# EAGLE design M162 (EAGLE 6.6.0)
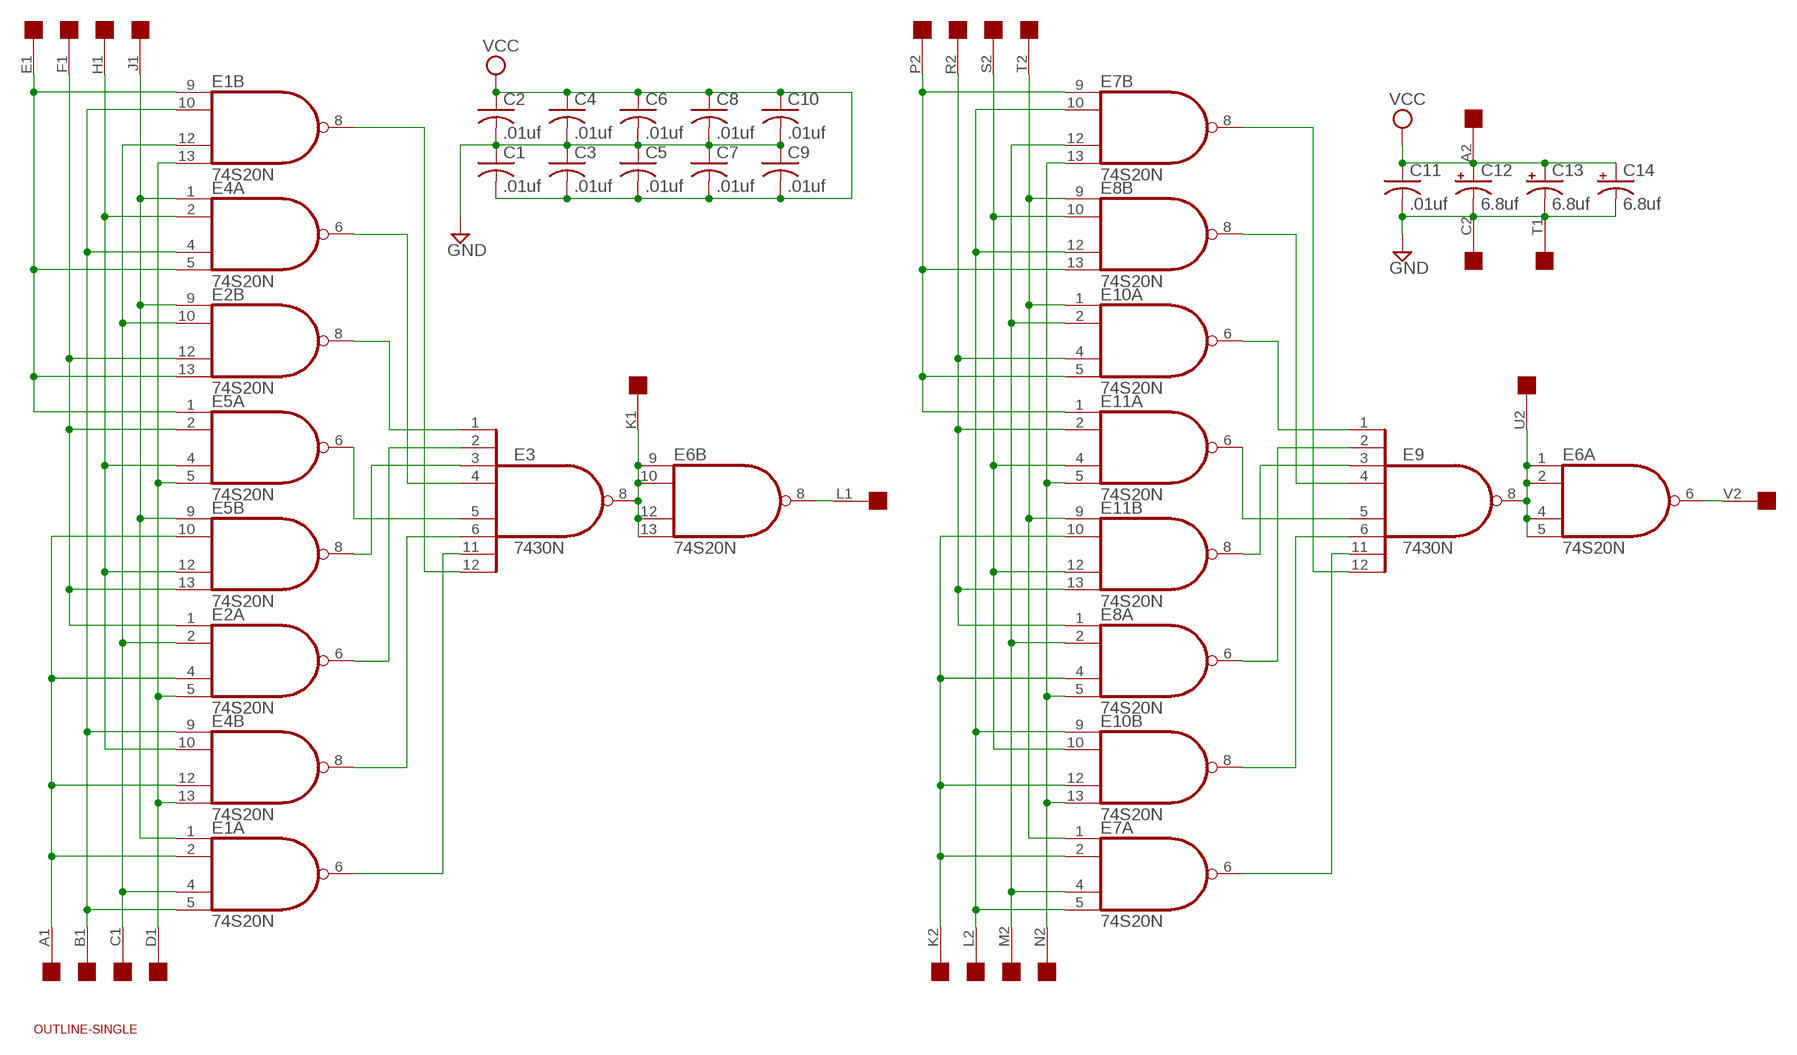
[diagram p0: schematic, sheet 1]

## Parts
C1  .01uf  C-US050-025X075  [C050-025X075]
C2  .01uf  C-US050-025X075  [C050-025X075]
C3  .01uf  C-US050-025X075  [C050-025X075]
C4  .01uf  C-US050-025X075  [C050-025X075]
C5  .01uf  C-US050-025X075  [C050-025X075]
C6  .01uf  C-US050-025X075  [C050-025X075]
C7  .01uf  C-US050-025X075  [C050-025X075]
C8  .01uf  C-US050-025X075  [C050-025X075]
C9  .01uf  C-US050-025X075  [C050-025X075]
C10  .01uf  C-US050-025X075  [C050-025X075]
C11  .01uf  C-US050-025X075  [C050-025X075]
C12  6.8uf  CPOL-USE22-6AXIAL  [E22-6]
C13  6.8uf  CPOL-USE22-6AXIAL  [E22-6]
C14  6.8uf  CPOL-USE22-6AXIAL  [E22-6]
E1  74S20N  [DIL14]
E2  74S20N  [DIL14]
E3  7430N  [DIL14]
E4  74S20N  [DIL14]
E5  74S20N  [DIL14]
E6  74S20N  [DIL14]
E7  74S20N  [DIL14]
E8  74S20N  [DIL14]
E9  7430N  [DIL14]
E10  74S20N  [DIL14]
E11  74S20N  [DIL14]
U$1  OUTLINE-SINGLE  [SINGLE]
U$2  EDGE-2CONNECTOR  [EDGE-CON2]

## Nets
GND: C1.1 C2.2 C3.1 C4.2 C5.1 C6.2 C7.1 C8.2 C9.1 C10.2 C11.2 C12.- C13.- C14.- U$2.C2 U$2.T1
N$1: E1.2(A:I1) E2.4(A:I2) E4.12(B:I2) E5.10(B:I1) U$2.A1
N$2: E1.13(B:I3) E2.5(A:I3) E4.13(B:I3) E5.5(A:I3) U$2.D1
N$3: E1.1(A:I0) E2.9(B:I0) E4.1(A:I0) E5.9(B:I0) U$2.J1
N$4: E4.2(A:I1) E4.10(B:I1) E5.4(A:I2) E5.12(B:I2) U$2.H1
N$5: E1.4(A:I2) E1.12(B:I2) E2.2(A:I1) E2.10(B:I1) U$2.C1
N$6: E1.5(A:I3) E1.10(B:I1) E4.4(A:I2) E4.9(B:I0) U$2.B1
N$7: E2.1(A:I0) E2.12(B:I2) E5.2(A:I1) E5.13(B:I3) U$2.F1
N$8: E1.9(B:I0) E2.13(B:I3) E4.5(A:I3) E5.1(A:I0) U$2.E1
N$9: E1.8(B:O) E3.12(I7)
N$10: E3.4(I3) E4.6(A:O)
N$11: E2.8(B:O) E3.1(I0)
N$12: E3.5(I4) E5.6(A:O)
N$13: E3.3(I2) E5.8(B:O)
N$14: E2.6(A:O) E3.2(I1)
N$15: E1.6(A:O) E3.11(I6)
N$16: E3.6(I5) E4.8(B:O)
N$17: E3.8(O) E6.9(B:I0) E6.10(B:I1) E6.12(B:I2) E6.13(B:I3) U$2.K1
N$18: E7.2(A:I1) E8.4(A:I2) E10.12(B:I2) E11.10(B:I1) U$2.K2
N$19: E7.13(B:I3) E8.5(A:I3) E10.13(B:I3) E11.5(A:I3) U$2.N2
N$20: E7.1(A:I0) E8.9(B:I0) E10.1(A:I0) E11.9(B:I0) U$2.T2
N$21: E8.10(B:I1) E10.10(B:I1) E11.4(A:I2) E11.12(B:I2) U$2.S2
N$22: E7.4(A:I2) E7.12(B:I2) E8.2(A:I1) E10.2(A:I1) U$2.M2
N$23: E7.5(A:I3) E7.10(B:I1) E8.12(B:I2) E10.9(B:I0) U$2.L2
N$24: E8.1(A:I0) E10.4(A:I2) E11.2(A:I1) E11.13(B:I3) U$2.R2
N$25: E7.9(B:I0) E8.13(B:I3) E10.5(A:I3) E11.1(A:I0) U$2.P2
N$26: E7.8(B:O) E9.12(I7)
N$27: E8.8(B:O) E9.4(I3)
N$28: E9.1(I0) E10.6(A:O)
N$29: E9.5(I4) E11.6(A:O)
N$30: E9.3(I2) E11.8(B:O)
N$31: E8.6(A:O) E9.2(I1)
N$32: E7.6(A:O) E9.11(I6)
N$33: E9.6(I5) E10.8(B:O)
N$34: E6.1(A:I0) E6.2(A:I1) E6.4(A:I2) E6.5(A:I3) E9.8(O) U$2.U2
N$35: E6.6(A:O) U$2.V2
N$36: E6.8(B:O) U$2.L1
VCC: C1.2 C2.1 C3.2 C4.1 C5.2 C6.1 C7.2 C8.1 C9.2 C10.1 C11.1 C12.+ C13.+ C14.+ U$2.A2
Unconnected: U$2.B2 U$2.D2 U$2.E2 U$2.F2 U$2.H2 U$2.J2 U$2.M1 U$2.N1 U$2.P1 U$2.R1 U$2.S1 U$2.U1 U$2.V1

## Power pins joined to a net without a drawn wire
GND: E1.7(P:GND) E2.7(P:GND) E3.7(GND) E4.7(P:GND) E5.7(P:GND) E6.7(P:GND) E7.7(P:GND) E8.7(P:GND) E9.7(GND) E10.7(P:GND) E11.7(P:GND)
VCC: E1.14(P:VCC) E2.14(P:VCC) E3.14(VCC) E4.14(P:VCC) E5.14(P:VCC) E6.14(P:VCC) E7.14(P:VCC) E8.14(P:VCC) E9.14(VCC) E10.14(P:VCC) E11.14(P:VCC)

## Library data of the parts
C1-C11 = rcl:C-US: CAPACITOR, American symbol
C12-C14 = rcl:CPOL-US: POLARIZED CAPACITOR, American symbol
E1 E2 E4-E8 E10 E11 = 74xx-us:74*20: Dual 4-input NAND gate
E3 E9 = 74xx-us:74*30: 8-input NAND gate
U$1 = dec-con:OUTLINE-*: Board outlines for DEC boards.
U$2 = dec-con:EDGE-2: Double-Sided DEC edge connector.

## Board
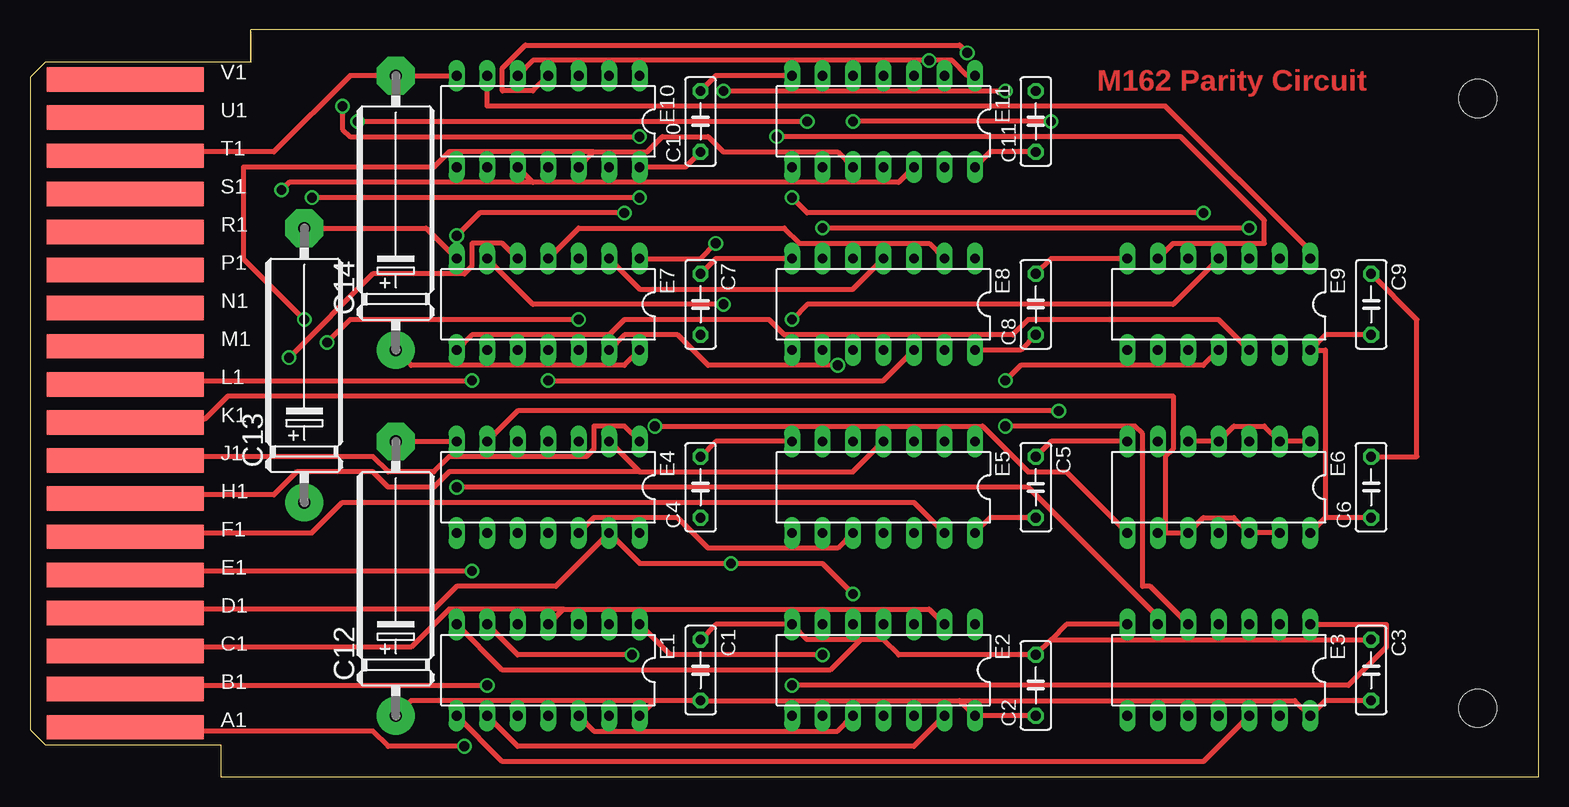
[diagram p1: board, top side]
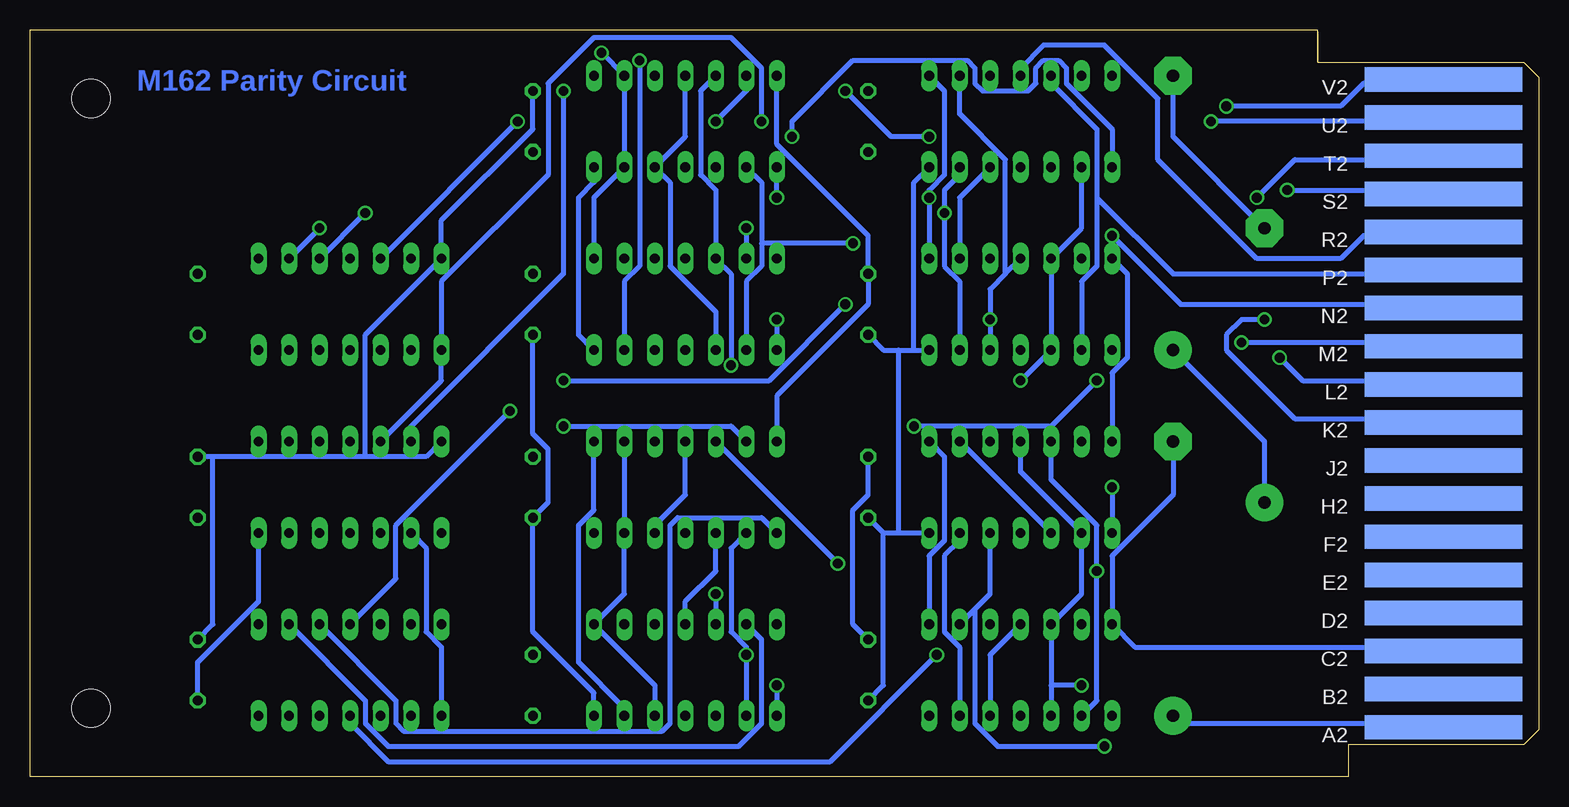
[diagram p2: board, bottom side, seen from below]

Size 125.73 x 62.23 mm. Coordinates in mm from the lower left corner, seen from the top.
Copper layers (1+16): Top 0.035mm / dielectric 1.5mm / Bottom 0.035mm
Design rules "16mils": minimum track width 16mil, minimum drill 32mil, track to track 15mil, track to pad 10mil, pad to pad 10mil, via to via 10mil, smd to smd 10mil, copper to edge 13mil, drill to drill 10mil, minimum pad ring 10mil, minimum via ring 8mil, stop-mask expansion 0mil, vias tented up to drill 0mil, thermal gap 10mil

### Footprints (pad centres in the part's own frame; a part is rotated, then mirrored left to right if it is on the bottom)
C050-025X075 = drill 0.813 octagon: 1 -2.54,0; 2 2.54,0
E22-6 = drill 1.016 pad 3.15: + -11.43,0 | drill 1.016 pad 3.15 octagon: - 11.43,0
DIL14 = drill 0.813 long: 1 -7.62,-3.81; 2 -5.08,-3.81; 3 -2.54,-3.81; 4 0,-3.81; 5 2.54,-3.81; 6 5.08,-3.81; 7 7.62,-3.81; 8 7.62,3.81; 9 5.08,3.81; 10 2.54,3.81; 11 0,3.81; 12 -2.54,3.81; 13 -5.08,3.81; 14 -7.62,3.81
SINGLE = hole 3.175: 120.65,56.515; 120.65,5.715
EDGE-CON2 = smd 13.106 x 2.032: A1 7.938,4.128; B1 7.938,7.303; C1 7.938,10.477; D1 7.938,13.652; E1 7.938,16.828; F1 7.938,20.003; H1 7.938,23.177; J1 7.938,26.352; K1 7.938,29.527; L1 7.938,32.703; M1 7.938,35.877; N1 7.938,39.053; P1 7.938,42.227; R1 7.938,45.403; S1 7.938,48.578; T1 7.938,51.752; U1 7.938,54.928; V1 7.938,58.102 | smd 13.106 x 2.032 bottom: A2 7.938,4.128; B2 7.938,7.303; C2 7.938,10.477; D2 7.938,13.652; E2 7.938,16.828; F2 7.938,20.003; H2 7.938,23.177; J2 7.938,26.352; K2 7.938,29.527; L2 7.938,32.703; M2 7.938,35.877; N2 7.938,39.053; P2 7.938,42.227; R2 7.938,45.403; S2 7.938,48.578; T2 7.938,51.752; U2 7.938,54.928; V2 7.938,58.102

### Placement (x,y rotation side)
C1  55.88,8.89 270 top
C2  83.82,7.62 90 top
C3  111.76,8.89 270 top
C4  55.88,24.13 90 top
C5  83.82,24.13 270 top
C6  111.76,24.13 90 top
C7  55.88,39.37 270 top
C8  83.82,39.37 90 top
C9  111.76,39.37 270 top
C10  55.88,54.61 90 top
C11  83.82,54.61 90 top
C12  30.48,16.51 90 top
C13  22.86,34.29 90 top
C14  30.48,46.99 90 top
E1  43.18,8.89 180 top
E2  71.12,8.89 180 top
E3  99.06,8.89 180 top
E4  43.18,24.13 180 top
E5  71.12,24.13 180 top
E6  99.06,24.13 180 top
E7  43.18,39.37 180 top
E8  71.12,39.37 180 top
E9  99.06,39.37 180 top
E10  43.18,54.61 180 top
E11  71.12,54.61 180 top
U$1  0,0 0 top
U$2  0,0 0 top

### Tracks (layer width: path | path; a pad name or v marks a point on that pad's centre or on a via)
GND
  Top 0.406: C12.- E4.7 | E10.7 C14.- 26.67,58.42 20.32,52.07 8.26,52.07 U$2.T1 | E7.7 33.02,45.72 C13.- | C8.2 85.09,43.18 E9.7 | C5.1 85.09,27.94 E6.7 | C9.1 115.57,38.1 115.57,26.67 C6.2 | C10.2 57.15,58.42 E11.7 | C4.2 57.15,27.94 E5.7 | C7.1 57.15,43.18 E8.7 | C1.1 57.15,12.7 E2.7 64.77,11.43 69.22,11.43 | 85.09,11.43 86.36,12.7 E3.7 | 85.09,11.43 C2.2 72.39,10.16 71.12,11.43 69.22,11.43 | 85.09,11.43 C3.1 | E1.7 39.37,8.89 66.68,8.89 69.22,11.43
  Bottom 0.406: C12.- 30.48,23.5 35.56,18.41 E1.7 33.66,10.79 8.26,10.79 U$2.C2 | C14.- 30.48,53.34 C13.- | E4.7 35.56,33.66 34.29,34.92 34.29,41.91 E7.7 | C11.2 83.82,53.98 91.44,46.35 E9.7 97.79,36.83 97.79,26.67 | 97.79,26.67 92.71,26.67 E6.7 | 97.79,26.67 110.49,26.67 | 110.49,26.67 C6.2 | E5.7 63.5,31.75 55.88,39.37 C7.1 55.88,45.09 63.5,52.7 E11.7 | C4.2 55.88,23.5 57.15,22.23 57.15,12.7 C1.1 | 110.49,26.67 110.49,12.7 C3.1
N$1  (via drill 0.81)
  Top 0.406: E4.12 46.99,21.59 53.98,21.59 56.52,19.05 67.31,19.05 E5.10 | v36.2,2.54 29.85,2.54 28.58,3.81 8.26,3.81 U$2.A1
  Bottom 0.406: E4.12 45.72,15.24 46.99,13.97 | E1.2 46.99,13.97 | E5.10 68.58,17.14 71.12,14.61 E2.4 | v36.2,2.54 45.09,2.54 46.99,4.45 46.99,13.97
N$2  (via drill 0.81)
  Top 0.406: v68.58,15.24 66.04,17.78 v58.42,17.78 50.8,17.78 E4.13 43.82,15.88 35.56,15.88 33.66,13.97 8.26,13.97 U$2.D1
  Bottom 0.406: E1.13 48.26,10.79 49.53,12.06 49.53,18.41 48.26,19.68 E4.13 | v68.58,15.24 E2.5 | v58.42,17.78 E5.5
N$3  (via drill 0.81)
  Top 0.406: E1.1 53.34,10.16 v66.04,10.16 | E4.1 49.53,29.21 46.99,29.21 46.99,27.3 46.36,26.67 34.93,26.67 33.66,25.4 29.85,25.4 28.58,26.67 8.26,26.67 U$2.J1
  Bottom 0.406: E1.1 50.8,18.41 49.53,19.68 49.53,26.67 E4.1 | E2.9 v66.04,10.16 66.04,10.79 67.31,12.06 67.31,19.05 E5.9
N$4
  Top 0.406: E5.4 68.58,25.4 50.8,25.4 | E4.2 50.8,25.4 | 50.8,25.4 34.93,25.4 33.66,24.13 29.85,24.13 28.58,25.4 22.23,25.4 20.32,23.5 8.26,23.5 U$2.H1
  Bottom 0.406: E5.4 71.12,23.5 73.66,20.95 E5.12 | E4.2 E4.10
N$5
  Top 0.406: E2.10 67.31,3.81 46.99,3.81 E1.12 | E2.2 74.93,13.97 44.45,13.97 | E1.4 44.45,13.97 | 44.45,13.97 34.93,13.97 31.75,10.79 8.26,10.79 U$2.C1
  Bottom 0.406: E1.12 45.72,10.16 E1.4
N$6  (via drill 0.81)
  Top 0.406: v38.1,7.62 8.26,7.62 U$2.B1
  Bottom 0.406: 40.64,7.62 E1.5 38.1,15.24 E4.9 43.18,25.4 E4.4 | 40.64,7.62 E1.10 | v38.1,7.62 40.64,7.62
N$7
  Top 0.406: E5.13 73.66,22.86 26.04,22.86 23.5,20.32 8.26,20.32 U$2.F1
  Bottom 0.406: E5.2 E5.13 76.2,15.24 E2.1 73.66,7.62 E2.12
N$8  (via drill 0.81)
  Top 0.406: E1.9 40.64,2.54 73.66,2.54 E2.13 | v36.83,17.14 8.26,17.14 U$2.E1
  Bottom 0.406: E4.5 40.64,24.77 36.83,20.95 v36.83,17.14 36.83,6.35 E1.9 | E5.1 78.74,22.23 80.01,20.95 80.01,9.53 76.2,5.71 E2.13
N$9
  Top 0.406: E1.8 39.37,1.27 97.79,1.27 E3.12
N$10  (via drill 0.81)
  Top 0.406: E4.6 40.64,30.48 v85.73,30.48
  Bottom 0.406: v85.73,30.48 95.25,20.95 95.25,16.51 E3.4
N$11  (via drill 0.81)
  Top 0.406: v63.5,7.62 109.86,7.62 113.03,10.79 113.03,12.7 E3.1
  Bottom 0.406: v63.5,7.62 E2.8
N$12  (via drill 0.81)
  Top 0.406: v81.28,29.21 92.08,29.21 92.71,28.57 92.71,15.88 93.35,15.88 E3.5
  Bottom 0.406: E5.6 67.31,29.21 v81.28,29.21
N$13
  Bottom 0.406: E5.8 64.77,21.59 71.76,21.59 72.39,20.95 72.39,4.45 73.03,3.81 94.62,3.81 95.25,4.45 95.25,6.35 E3.3
N$14
  Bottom 0.406: E2.6 64.77,11.43 64.77,4.45 66.68,2.54 95.89,2.54 97.79,4.45 97.79,6.35 E3.2
N$15  (via drill 0.81)
  Top 0.406: E1.6 40.64,10.16 v50.17,10.16
  Bottom 0.406: v50.17,10.16 59.06,1.27 95.89,1.27 99.06,4.45 E3.11
N$16  (via drill 0.81)
  Top 0.406: v35.56,24.13 83.19,24.13 93.98,13.34 E3.6
  Bottom 0.406: v35.56,24.13 E4.8
N$17
  Top 0.406: E6.13 E6.12 100.33,21.59 97.79,21.59 E6.10 94.62,20.32 | 94.62,20.32 94.62,26.67 95.25,27.3 95.25,31.75 16.51,31.75 14.61,29.84 8.26,29.84 U$2.K1 | 94.62,20.32 E6.9
  Bottom 0.406: E3.8 91.44,10.79 92.71,12.06 92.71,19.05 E6.9
N$18  (via drill 0.81)
  Top 0.406: E11.10 67.31,52.07 57.79,52.07 56.52,53.34 52.71,53.34 51.44,52.07 46.99,52.07 | E10.12 46.99,52.07 | E8.4 68.58,40.64 50.8,40.64 E7.2 | v22.86,38.1 17.78,43.18 17.78,50.8 33.66,50.8 34.93,52.07 46.99,52.07
  Bottom 0.406: E7.2 48.26,48.26 E10.12 | v22.86,38.1 24.77,38.1 26.04,36.83 26.04,35.56 20.32,29.84 8.26,29.84 U$2.K2
N$19  (via drill 0.81)
  Top 0.406: E7.13 49.53,36.83 53.98,36.83 56.52,34.29 v67.31,34.29 | v35.56,45.09 37.47,46.99 v49.53,46.99
  Bottom 0.406: E7.13 48.26,41.27 49.53,42.55 v49.53,46.99 49.53,48.9 48.26,50.16 E10.13 | E11.5 69.85,57.15 69.85,50.16 68.58,48.9 E8.5 67.31,41.91 v67.31,34.29 | v35.56,45.09 29.85,39.37 8.26,39.37 U$2.N2
N$20  (via drill 0.81)
  Top 0.406: v57.15,44.45 55.88,43.18 E7.1 | v50.8,48.26 v23.5,48.26
  Bottom 0.406: E8.9 66.04,41.27 64.77,42.55 64.77,44.45 | 64.77,44.45 64.77,49.53 E11.9 | E7.1 v50.8,48.26 50.8,48.9 49.53,50.16 49.53,57.15 E10.1 | v57.15,44.45 64.77,44.45 | v23.5,48.26 20.32,51.44 8.26,51.44 U$2.T2
N$21  (via drill 0.81)
  Top 0.406: 41.91,49.53 E10.10 | 41.91,49.53 72.39,49.53 E11.12 | v20.96,48.9 21.59,49.53 41.91,49.53
  Bottom 0.406: E8.10 68.58,38.73 72.39,42.55 72.39,49.53 E11.12 71.12,53.34 E11.4 | v20.96,48.9 8.26,48.9 U$2.S2
N$22  (via drill 0.81)
  Top 0.406: E8.2 74.93,44.45 64.14,44.45 62.87,45.72 45.72,45.72 E7.4 | v24.77,36.2 26.67,38.1 v45.72,38.1
  Bottom 0.406: E7.12 v45.72,38.1 45.72,40.64 44.45,41.91 | E7.4 44.45,41.91 | E10.2 48.26,55.24 44.45,51.44 44.45,41.91 | v24.77,36.2 8.26,36.2 U$2.M2
N$23  (via drill 0.81)
  Top 0.406: E8.12 71.12,33.02 v43.18,33.02 | v21.59,34.92 28.58,41.91 36.2,41.91 36.83,42.55 36.83,44.45 39.37,44.45 E7.5
  Bottom 0.406: E10.9 38.1,45.72 E7.5 E7.10 v43.18,33.02 | v21.59,34.92 19.69,33.02 8.26,33.02 U$2.L2
N$24  (via drill 0.81)
  Top 0.406: v78.11,60.33 77.47,60.96 41.28,60.96 39.37,59.05 39.37,57.15 41.91,57.15 E10.4
  Bottom 0.406: E8.1 78.74,48.26 E11.13 E11.2 v78.11,60.33 | E10.4 43.18,59.05 41.28,60.96 36.2,60.96 31.75,56.52 31.75,51.44 23.5,43.18 16.51,43.18 14.61,45.09 8.26,45.09 U$2.R2
N$25  (via drill 0.81)
  Top 0.406: E11.1 78.11,58.42 76.84,59.69 v74.93,59.69 41.91,59.69 E10.5
  Bottom 0.406: E7.9 38.1,41.27 36.83,42.55 36.83,48.26 | 36.83,48.26 36.83,53.98 40.64,57.78 E10.5 | E8.13 76.2,41.27 74.93,42.55 v74.93,59.69 | 36.83,48.26 30.48,41.91 8.26,41.91 U$2.P2
N$26
  Top 0.406: E7.8 36.83,36.83 48.26,36.83 49.53,38.1 61.6,38.1 62.87,36.83 81.92,36.83 83.19,38.1 99.06,38.1 E9.12
N$27  (via drill 0.81)
  Top 0.406: v63.5,38.1 64.77,39.37 95.25,39.37 E9.4
  Bottom 0.406: v63.5,38.1 E8.8
N$28
  Top 0.406: E10.6 38.1,55.88 94.62,55.88 106.68,43.81 E9.1
N$29  (via drill 0.81)
  Top 0.406: v85.09,54.61 v68.58,54.61
  Bottom 0.406: E11.6 66.04,57.15 v68.58,54.61 | E9.5 v85.09,54.61
N$30  (via drill 0.81)
  Top 0.406: v63.5,48.26 64.77,46.99 v97.79,46.99
  Bottom 0.406: v63.5,48.26 E11.8 | E9.3 v97.79,46.99
N$31  (via drill 0.81)
  Top 0.406: v101.6,45.72 v66.04,45.72
  Bottom 0.406: v66.04,45.72 E8.6 | E9.2 v101.6,45.72
N$32  (via drill 0.81)
  Top 0.406: E7.6 41.91,39.37 v57.79,39.37 | v81.28,33.02 82.55,34.29 97.79,34.29 E9.11
  Bottom 0.406: v57.79,39.37 64.14,33.02 v81.28,33.02
N$33  (via drill 0.81)
  Top 0.406: v62.23,53.34 95.89,53.34 102.87,46.35 102.87,44.45 95.25,44.45 E9.6
  Bottom 0.406: E10.8 35.56,53.98 39.37,57.78 39.37,59.05 40.01,59.69 41.28,59.69 41.91,59.05 41.91,57.78 42.55,57.15 46.36,57.15 46.99,57.78 46.99,59.05 47.63,59.69 57.15,59.69 62.23,54.61 v62.23,53.34
N$34  (via drill 0.81)
  Top 0.406: E6.1 E6.2 102.87,29.21 100.33,29.21 E6.4 E6.5 | v27.31,54.61 v64.77,54.61
  Bottom 0.406: E6.5 91.44,33.02 E9.8 91.44,41.27 82.55,50.16 82.55,57.78 78.74,61.59 67.31,61.59 64.77,59.05 v64.77,54.61 | v27.31,54.61 8.26,54.61 U$2.U2
N$35  (via drill 0.81)
  Top 0.406: v57.79,57.15 v81.28,57.15 | v50.8,53.34 26.67,53.34 26.04,53.98 v26.04,55.88
  Bottom 0.406: E6.6 93.98,29.21 81.28,41.91 v81.28,57.15 | v57.79,57.15 53.98,53.34 v50.8,53.34 | v26.04,55.88 16.51,55.88 14.61,57.78 8.26,57.78 U$2.V2
N$36  (via drill 0.81)
  Top 0.406: E6.8 86.36,25.4 83.19,25.4 79.38,29.21 v52.07,29.21 | v36.83,33.02 8.26,33.02 U$2.L1
  Bottom 0.406: v52.07,29.21 40.64,29.21 v36.83,33.02
VCC
  Top 0.406: 107.95,21.59 E6.14 | C6.1 107.95,21.59 | C9.2 107.95,36.83 E9.14 107.95,35.56 107.95,21.59 | C3.2 107.95,6.35 E3.14 105.41,6.35 77.47,6.35 | E11.14 80.01,52.07 C11.1 | E8.14 82.55,35.56 C8.1 | E5.14 80.01,21.59 C5.2 | E10.14 54.61,50.8 C10.1 | C2.1 E2.14 77.47,6.35 | 52.07,6.35 E1.14 | 52.07,6.35 C1.2 77.47,6.35 | C12.+ 31.75,6.35 52.07,6.35 | C14.+ 31.75,34.29 49.53,34.29 E7.14
  Bottom 0.406: C13.+ 22.86,27.94 C14.+ | 53.34,35.56 54.61,35.56 C7.2 | 53.34,35.56 52.07,35.56 | 52.07,35.56 E7.14 | 54.61,20.32 53.34,20.32 | 53.34,20.32 E4.14 | C4.1 54.61,20.32 | 54.61,20.32 54.61,7.62 C1.2 | 53.34,20.32 53.34,35.56 | E10.14 52.07,49.53 52.07,35.56 | E2.14 78.74,6.99 83.82,12.06 C5.2 82.55,22.86 82.55,27.3 83.82,28.57 C8.1 | E11.14 78.74,49.53 80.01,48.26 80.01,36.83 E8.14 | E6.14 106.68,14.61 111.76,9.53 C3.2 | C12.+ 29.85,4.45 8.26,4.45 U$2.A2

### Text on the board
Top: M162 Parity Circuit
Bottom: M162 Parity Circuit